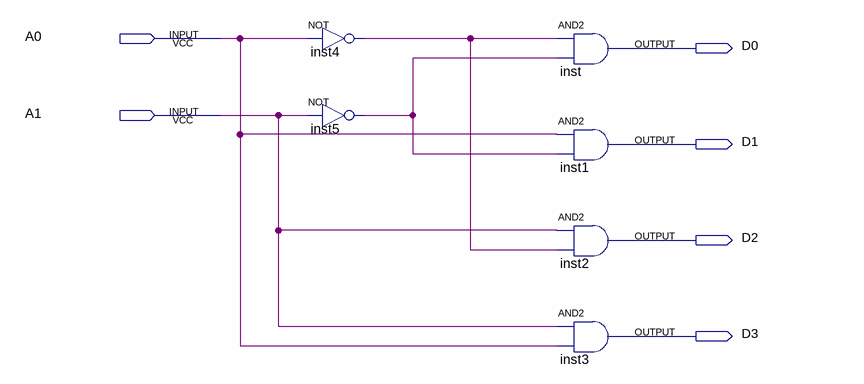
[diagram p0: schematic sheet]
// Quartus schematic 2-to-4decoder.bdf as structural Verilog: 6 symbols, 6 pins
module \2-to-4decoder  (
  input  A0,
  input  A1,
  output D0,
  output D1,
  output D2,
  output D3
);

  wire inst4_out, inst5_out;

  not inst4 (inst4_out, A0);
  not inst5 (inst5_out, A1);
  and inst (D0, inst4_out, inst5_out);
  and inst1 (D1, A0, inst5_out);
  and inst2 (D2, A1, inst4_out);
  and inst3 (D3, A1, A0);
endmodule
